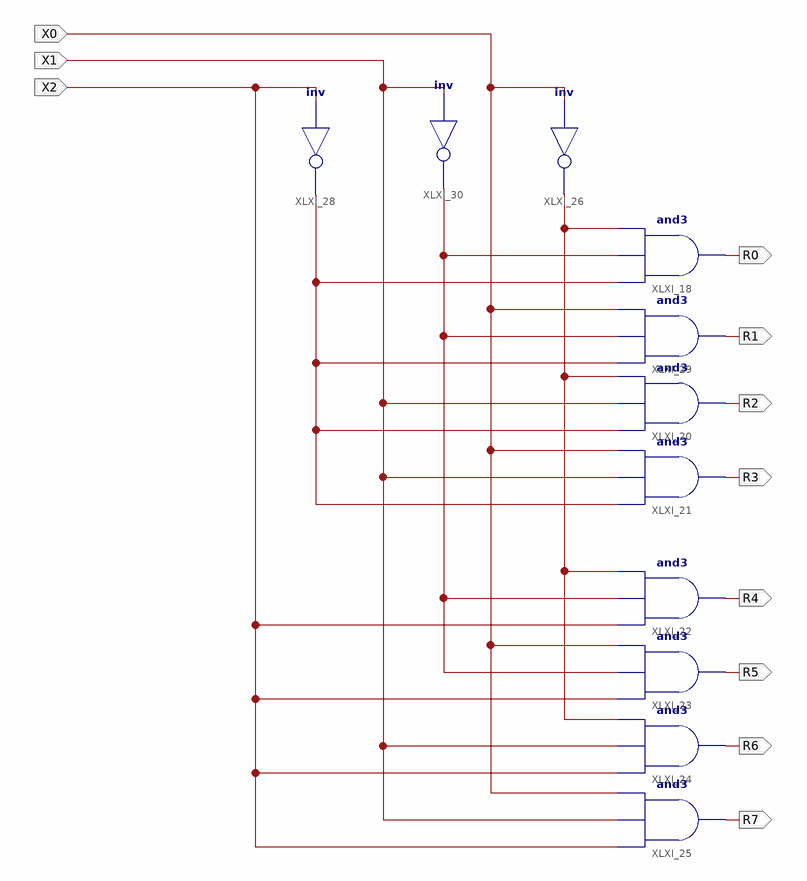
[diagram p0: schematic sheet 1]
// Xilinx ISE schematic decoder3_to_8.sch (spartan3e) as structural Verilog: 11 symbols, 11 ports
module decoder3_to_8 (
  input  X2,
  input  X0,
  input  X1,
  output R0,
  output R1,
  output R2,
  output R3,
  output R4,
  output R5,
  output R6,
  output R7
);

  wire XLXN_1, XLXN_12, XLXN_25;

  and XLXI_18 (R0, XLXN_25, XLXN_1, XLXN_12);
  and XLXI_20 (R2, XLXN_25, X1, XLXN_12);
  and XLXI_21 (R3, XLXN_25, X1, X0);
  and XLXI_22 (R4, X2, XLXN_1, XLXN_12);
  and XLXI_23 (R5, X2, XLXN_1, X0);
  and XLXI_24 (R6, X2, X1, XLXN_12);
  and XLXI_25 (R7, X2, X1, X0);
  not XLXI_26 (XLXN_12, X0);
  not XLXI_28 (XLXN_25, X2);
  and XLXI_29 (R1, XLXN_25, XLXN_1, X0);
  not XLXI_30 (XLXN_1, X1);
endmodule
